# Altium schematic sheet PSU.SchDoc
size A; SheetNumber: 2; SheetTotal: 4
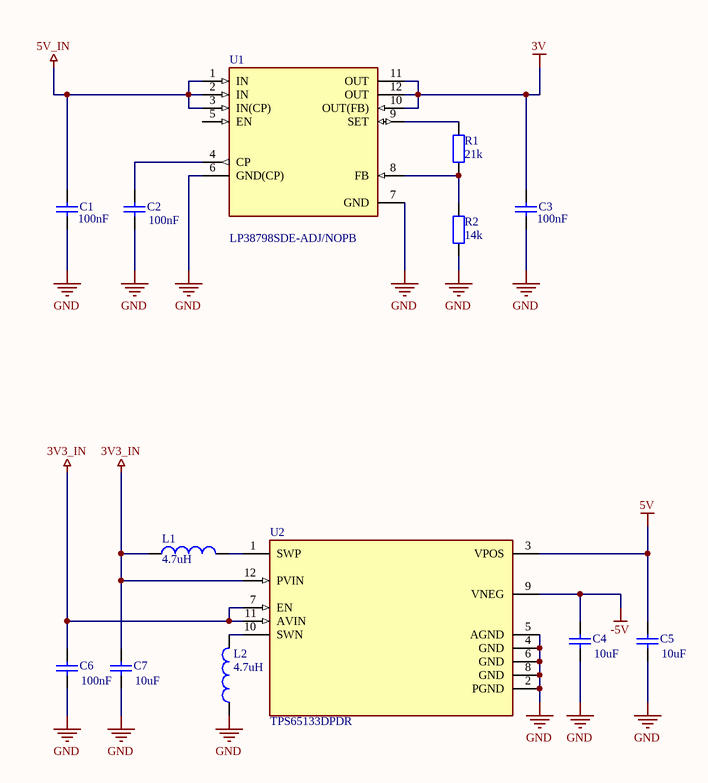
[diagram p0: PSU.SchDoc]

## Parts
C1  value 100nF  [C1206]  (hidden comment: Cap Semi)
C2  value 100nF  [C1206]  (hidden comment: Cap Semi)
C3  value 100nF  [C1206]  (hidden comment: Cap Semi)
C4  value 10uF  [C1206]  (hidden comment: Cap Semi)
C5  value 10uF  [C1206]  (hidden comment: Cap Semi)
C6  value 100nF  [C1206]  (hidden comment: Cap Semi)
C7  value 10uF  [C1206]  (hidden comment: Cap Semi)
L1  value 4.7uH  [0402-A]  (hidden comment: Inductor)
L2  value 4.7uH  [0402-A]  (hidden comment: Inductor)
R1  value 21k  [AXIAL-0.4]  (hidden comment: Res2)
R2  value 14k  [AXIAL-0.4]  (hidden comment: Res2)
U1  LP38798SDE-ADJ-NOPB  [Texas_Instruments_DNT0012B_0]  (value not drawn)
U2  TPS65133DPDR  [FP-DPD0012A-MFG]

## Nets
3V: C3.2 U1.10(OUT(FB)) U1.11(OUT) U1.12(OUT)
3V3_IN: C6.2 C7.2 L1.1 U2.7(EN) U2.11(AVIN) U2.12(PVIN)
5V: C5.2 U2.3(VPOS)
5V_IN: C1.2 U1.1(IN) U1.2(IN) U1.3(IN(CP))
-5V: C4.2 U2.9(VNEG)
GND: C1.1 C2.1 C3.1 C4.1 C5.1 C6.1 C7.1 L2.1 R2.1 U1.6(GND(CP)) U1.7(GND) U2.2(PGND) U2.4(GND) U2.5(AGND) U2.6(GND) U2.8(GND)
NetC2_2: C2.2 U1.4(CP)
NetL1_2: L1.2 U2.1(SWP)
NetL2_2: L2.2 U2.10(SWN)
NetR1_1: R1.1 R2.2 U1.8(FB)
NetR1_2: R1.2 U1.9(SET)

Not connected (* = marked no-connect by the designer): U1 5(EN)

## Library data of the parts
C1-C7 = Cap Semi: Capacitor (Semiconductor SIM Model); Published: 8-Jun-2000; LatestRevisionDate: 29-May-2009; LatestRevisionNote: IPC-7351 Footprint Added.; PackageReference: C1206; Publisher: Altium Limited; PackageDescription: Chip Capacitor
L1 L2 = Inductor: Code_IEC: 1005; Published: 8-Jun-2000; LatestRevisionDate: 29-May-2009; LatestRevisionNote: IPC-7351 Footprint Added.; PackageReference: 0402-A; Publisher: Altium Limited; PackageDescription: Chip Inductor; Code_JEITA: 0402
R1 R2 = Res2: Resistor; Published: 8-Jun-2000; LatestRevisionDate: 17-Jul-2002; LatestRevisionNote: Re-released for DXP Platform.; PackageReference: AXIAL-0.4; Publisher: Altium Limited; PackageDescription: Axial Device, Thru-Hole; 2 Leads; 0.4 in Pin Spacing
U1 = LP38798SDE-ADJ/NOPB: IC REG LIN POS ADJ 800MA 12WSON; Manufacturer: Texas Instruments; Accuracy Percentage: 1%; Capacitance: SKIP; Dropout Voltage: 200mV; Library Path1: parts/IC_Texas_Instruments_LP38798SDE-ADJ-NOPB_eec.SchLib; Max Junction Temp: +125°C; Max Supply Voltage: 20V; Min Supply Voltage: 3V; Number Of Outputs: 1; Output Voltage: 1.2-19.8V; Value: SKIP; Verification Version: 0.0.0.1; Part Number: LP38798SDE-ADJ/NOPB; Datasheet Path: datasheets/IC_Texas_Instruments_LP38798SDE-ADJ-NOPB_eec.pdf; ComponentLink1Description: Upverter; ComponentLink1URL: https://upverter.com/upn/revision/7cdef7abd6330448/; ComponentLink2Description: Datasheet; ComponentLink2URL: http://www.ti.com/lit/ds/symlink/lp38798.pdf; Datasheet Path1: datasheets/IC_Texas_Instruments_LP38798SDE-ADJ-NOPB_eec.pdf; Digikey Description: IC REG LIN POS ADJ 800MA 12WSON; Digikey Part Number: 296-36225-1-ND; Height: 0.8mm; Inductance: SKIP; Lead Free: yes; Library Ref1: LP38798SDE-ADJ-NOPB; Mouser Description: LDO Voltage Regulators 800mA Ultra-Lo Noise Hi PSRR LDO; Mouser Part Number: 595-LP38798SDEADJNPB; Output Current: 800mA; Package: DNT0012B; Price: 2.77405399243; Resistance: SKIP; RoHS: TRUE; Supplier 1: Digi-Key; Supplier 2: Mouser; Supplier Part Number 1: 296-36225-1-ND; Supplier Part Number 2: 595-LP38798SDEADJNPB; Temperature: -40°C to +125°C; Temperature Range High: +125°C; Temperature Range Low: -40°C; Voltage: SKIP; helpURL: https://upverter.com/upn/revision/7cdef7abd6330448/
U2 = CMP-04918-000430-1: IC REG AMOLED DISPL 2OUT 12WSON; Number of Channels: 2; Max Supply Voltage: 5V; Min Supply Voltage: 2.9V; Output Voltage: -5V; Mount: Surface Mount; Case/Package: QFN; Packaging: Tape and Reel; Lead Free: Lead Free; Radiation Hardening: No; Min Operating Temperature: -40°C; Number of Outputs: 2; Max Operating Temperature: 85°C; Number of Pins: 12; RoHS Compliant: Yes; Package Quantity: 3000